# Altium schematic sheet MIC3.SchDoc: Mic
size A4; Organization: Autobot Limited; Address1: 96, boulevard Bessiere; Address4: 75017 PARIS; SheetNumber: 4
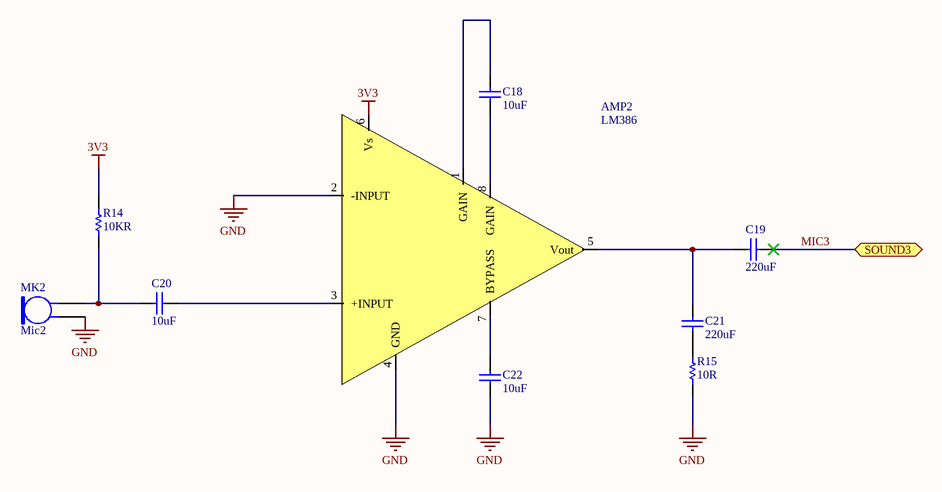
[diagram p0: MIC3.SchDoc]

## Parts
AMP2  LM386  [Ampli]
C18  10uF  [CAPC1608N]
C19  220uF  [CAPC1608N]
C20  10uF  [CAPC1608N]
C21  220uF  [CAPC1608N]
C22  10uF  [CAPC1608N]
MK2  Mic2  [PIN2]
R14  10KR  [RESC1608N]
R15  10R  [RESC1608N]

## Ports
SOUND3

## Nets
3V3: AMP2.6(Vs) R14.1
GND: AMP2.2(-INPUT) AMP2.4(GND) C22.2 MK2.1 R15.2
MIC3: C19.1 ; port SOUND3
NetAMP2_1: AMP2.1(GAIN) C18.1
NetAMP2_3: AMP2.3(+INPUT) C20.1
NetAMP2_5: AMP2.5(Vout) C19.2 C21.1
NetAMP2_7: AMP2.7(BYPASS) C22.1
NetAMP2_8: AMP2.8(GAIN) C18.2
NetC20_2: C20.2 MK2.2 R14.2
NetC21_2: C21.2 R15.1

## Notes on the sheet
- Title
- Size:
- Date:
- A4
- Number:
- Time:
- Revision:
- Sheet
- of
- File:

## Library data of the parts
C18-C22 = Cap: Capacitor; Published: 8-Jun-2000; LatestRevisionDate: 17-Jul-2002; LatestRevisionNote: Re-released for DXP Platform.; PackageReference: RAD-0.3; Publisher: Altium Limited; PackageDescription: Radial Cap, Thru-Hole; 2 Leads; 0.3 in Pin Spacing
  C18 C20 C22: Value: 10uF
  C19 C21: Value: 220uF
MK2 = Mic2: Microphone; Fabricant: PRO SIGNAL; Fournisseur: Farnell; RefFabricant: ABM-708-RC; RefFournisseur: 1736564; Published: 24-Mar-1999; LatestRevisionDate: 17-Jul-2002; LatestRevisionNote: Re-released for DXP Platform.; PackageReference: PIN2; Publisher: Altium Limited
R14 R15 = Res1: Resistor; Published: 8-Jun-2000; LatestRevisionDate: 17-Jul-2002; LatestRevisionNote: Re-released for DXP Platform.; PackageReference: AXIAL-0.3; Publisher: Altium Limited; PackageDescription: Axial Device, Thru-Hole; 2 Leads; 0.3 in Pin Spacing
  R14: Value: 10KR
  R15: Value: 10R